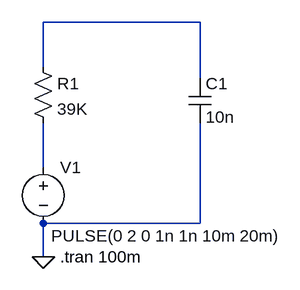
[diagram p0: schematic lab3_rc.asc]
lab3_rc.asc, the LTspice schematic file:
Version 4
SHEET 1 880 680
WIRE 320 -16 96 -16
WIRE 96 48 96 -16
WIRE 320 64 320 -16
WIRE 96 192 96 128
WIRE 320 272 320 128
WIRE 320 272 96 272
WIRE 96 320 96 272
FLAG 96 320 0
SYMBOL voltage 96 176 R0
WINDOW 123 0 0 Left 0
WINDOW 39 0 0 Left 0
WINDOW 3 11 114 Left 2
SYMATTR Value PULSE(0 2 0 1n 1n 10m 20m)
SYMATTR InstName V1
SYMBOL res 80 32 R0
SYMATTR InstName R1
SYMATTR Value 39K
SYMBOL cap 304 64 R0
SYMATTR InstName C1
SYMATTR Value 10n
TEXT 120 320 Left 2 !.tran 100m

The netlist it stands for:
* lab3_rc.asc
V1 N002 0 PULSE(0 2 0 1n 1n 10m 20m)
R1 N001 N002 39K
C1 N001 0 10n
.tran 100m
.backanno
.end